# Altium schematic sheet RMP_SLIDER_MODULE.SchDoc
size Letter; SheetNumber: 4; SheetTotal: 7
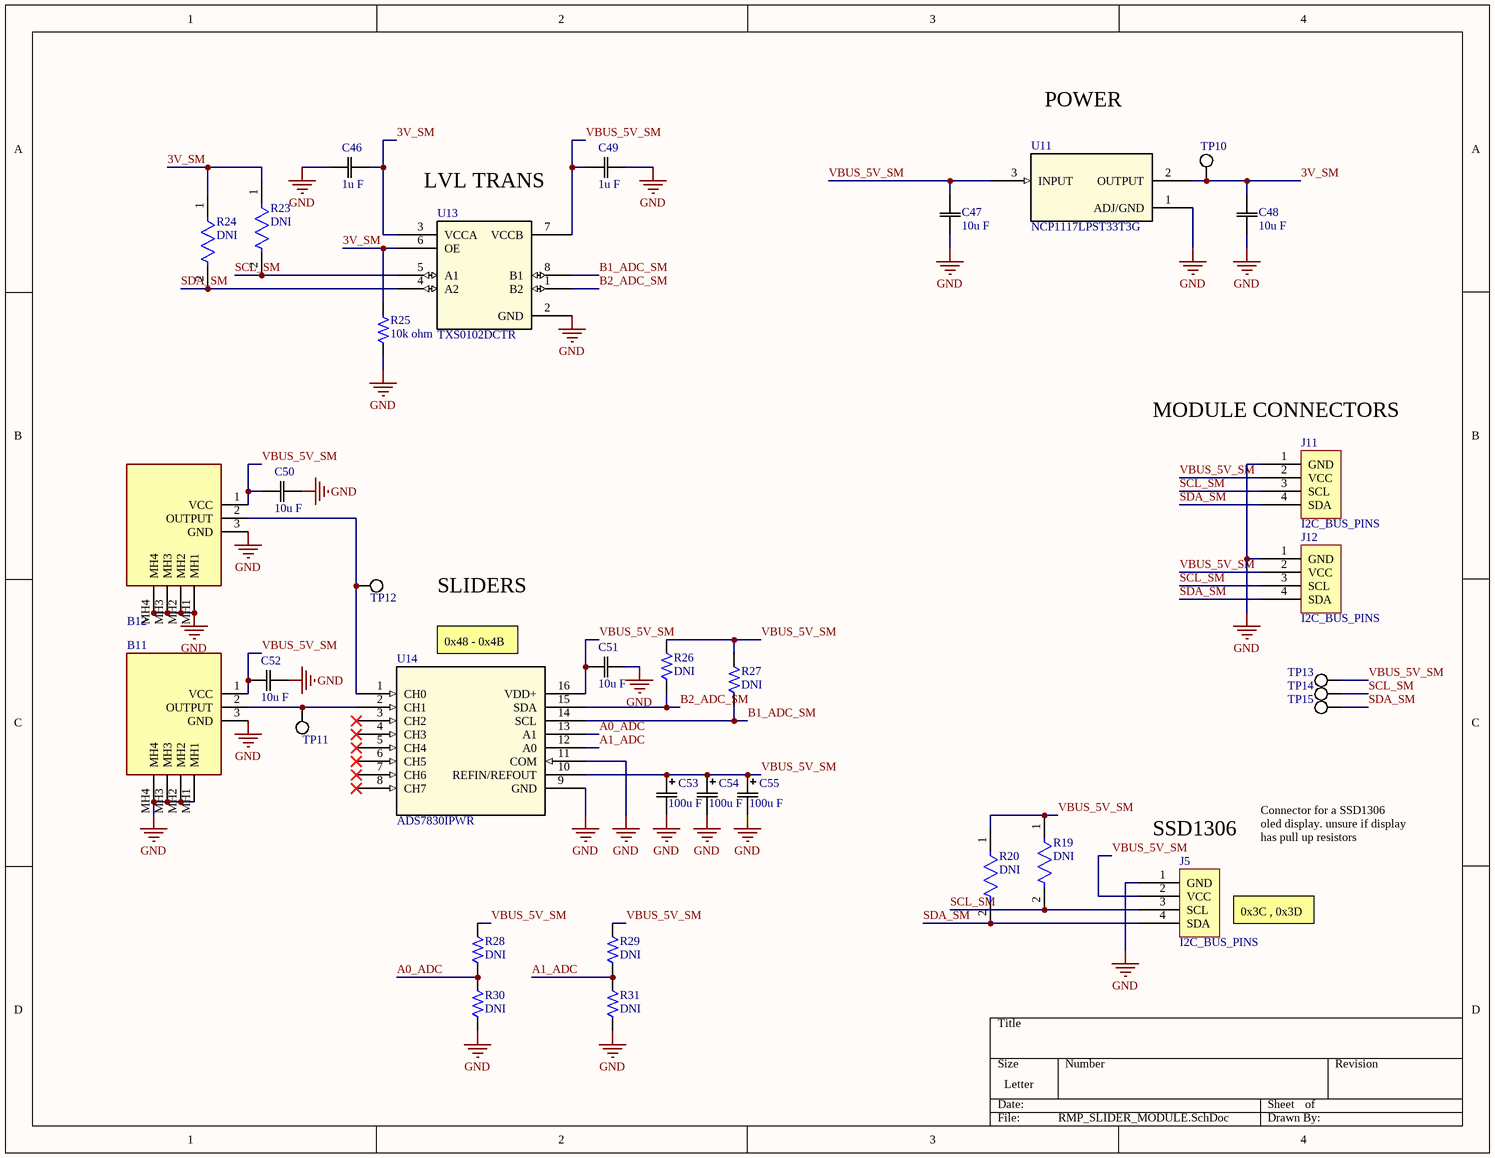
[diagram p0: RMP_SLIDER_MODULE.SchDoc]

## Parts
B11  PTA3043-2010CIB103  [PTA30432010CIB103]  (value not drawn)
B12  PTA3043-2010CIB103  [PTA30432010CIB103]  (value not drawn)
C46  value 1u F  [CAP_CL21B105KAFNNNE_SAM-M]  (hidden comment: CL21B105KAFNNNE)
C47  value 10u F  [G-21_MUR-M]  (hidden comment: GRM21BR61C106KE15K)
C48  value 10u F  [G-21_MUR-M]  (hidden comment: GRM21BR61C106KE15K)
C49  value 1u F  [CAP_CL21B105KAFNNNE_SAM-M]  (hidden comment: CL21B105KAFNNNE)
C50  value 10u F  [G-21_MUR-M]  (hidden comment: GRM21BR61C106KE15K)
C51  value 10u F  [G-21_MUR-M]  (hidden comment: GRM21BR61C106KE15K)
C52  value 10u F  [G-21_MUR-M]  (hidden comment: GRM21BR61C106KE15K)
C53  value 100u F  [CAP_YX_6P3X11_RUB]  (hidden comment: 35YXJ100M6.3X11)
C54  value 100u F  [CAP_YX_6P3X11_RUB]  (hidden comment: 35YXJ100M6.3X11)
C55  value 100u F  [CAP_YX_6P3X11_RUB]  (hidden comment: 35YXJ100M6.3X11)
J5  I2C_BUS_PINS  [4 PIN HEADER]
J11  I2C_BUS_PINS  [4 PIN HEADER]
J12  I2C_BUS_PINS  [4 PIN HEADER]
R19  Resistance: DNI  [FP-RT0805-MFG]  (hidden comment: RT0805FRE134K7L)
R20  Resistance: DNI  [FP-RT0805-MFG]  (hidden comment: RT0805FRE134K7L)
R23  Resistance: DNI  [FP-RT0805-MFG]  (hidden comment: RT0805FRE134K7L)
R24  Resistance: DNI  [FP-RT0805-MFG]  (hidden comment: RT0805FRE134K7L)
R25  value 10k ohm  [STA_RNCP0805_STP-M]  (hidden comment: RNCP0805FTD10K0)
R26  value DNI  [STA_RNCP0805_STP-M]  (hidden comment: RNCP0805FTD10K0)
R27  value DNI  [STA_RNCP0805_STP-M]  (hidden comment: RNCP0805FTD10K0)
R28  value DNI  [STA_RNCP0805_STP-M]  (hidden comment: RNCP0805FTD10K0)
R29  value DNI  [STA_RNCP0805_STP-M]  (hidden comment: RNCP0805FTD10K0)
R30  value DNI  [STA_RNCP0805_STP-M]  (hidden comment: RNCP0805FTD10K0)
R31  value DNI  [STA_RNCP0805_STP-M]  (hidden comment: RNCP0805FTD10K0)
TP10  TestPoint  [Testpoint]  (value not drawn)
TP11  TestPoint  [Testpoint]  (value not drawn)
TP12  TestPoint  [Testpoint]  (value not drawn)
TP13  TestPoint  [Testpoint]  (value not drawn)
TP14  TestPoint  [Testpoint]  (value not drawn)
TP15  TestPoint  [Testpoint]  (value not drawn)
U11  NCP1117LPST33T3G  [SOT223-3_ONS-M]
U13  TXS0102DCTR  [DCT8]
U14  ADS7830IPWR  [PW16-M]

## Nets
GND: B11.3(GND) B11.MH1 B11.MH2 B11.MH3 B11.MH4 B12.3(GND) B12.MH1 B12.MH2 B12.MH3 B12.MH4 C46.2 C47.1 C48.1 C49.1 C50.1 C51.1 C52.2 C53.2 C54.2 C55.2 J5.1(GND) J11.1(GND) J12.1(GND) R25.2 R30.1 R31.1 U11.1(ADJ/GND) U13.2(GND) U14.9(GND) U14.11(COM)
3V_SM: C46.1 C48.2 R23.1 R24.1 R25.1 TP10.1 U11.2(OUTPUT) U13.3(VCCA) U13.6(OE)
A0_ADC: R28.1 R30.2 U14.13(A1)
A1_ADC: R29.1 R31.2 U14.12(A0)
B1_ADC_SM: R27.1 U13.8(B1) U14.14(SCL)
B2_ADC_SM: R26.1 U13.1(B2) U14.15(SDA)
SCL_SM: J5.3(SCL) J11.3(SCL) J12.3(SCL) R19.2 R23.2 TP14.1 U13.5(A1)
SDA_SM: J5.4(SDA) J11.4(SDA) J12.4(SDA) R20.2 R24.2 TP15.1 U13.4(A2)
VBUS_5V_SM: B11.1(VCC) B12.1(VCC) C47.2 C49.2 C50.2 C51.2 C52.1 C53.1 C54.1 C55.1 J5.2(VCC) J11.2(VCC) J12.2(VCC) R19.1 R20.1 R26.2 R27.2 R28.2 R29.2 TP13.1 U11.3(INPUT) U13.7(VCCB) U14.10(REFIN/REFOUT) U14.16(VDD+)
NetB11_2: B11.2(OUTPUT) TP11.1 U14.2(CH1)
NetB12_2: B12.2(OUTPUT) TP12.1 U14.1(CH0)

Not connected (* = marked no-connect by the designer): U14 3(CH2)* 4(CH3)* 5(CH4)* 6(CH5)* 7(CH6)* 8(CH7)*

## Notes on the sheet
- POWER
- (near U13) LVL TRANS
- (near J11) MODULE CONNECTORS
- SLIDERS
- (near U14) 0x48 - 0x4B
- (near J5) SSD1306
- Connector for a SSD1306 oled display. unsure if display has pull up resistors
- 0x3C , 0x3D

## Library data of the parts
B11 B12 = PTA3043-2010CIB103: 10 kOhms 0.2W, 1/5W Through Hole Slide Potentiometer Top Adjustment Type; Manufacturer_Name: Bourns; Geometry.Height: 16.5mm; Manufacturer_Part_Number: PTA3043-2010CIB103; Mouser Part Number: 652-PTA3432010CIB103; Mouser Price/Stock: https://www.mouser.co.uk/ProductDetail/Bourns/PTA3043-2010CIB103?qs=QARuOjD9jaF0iQfIvhCxcQ%3D%3D; Arrow Part Number: PTA3043-2010CIB103; Arrow Price/Stock: null?utm_currency=USD&region=nac; Datasheet Link: https://www.bourns.com/docs/Product-Datasheets/pta.pdf
C46 C49 = CAP_CL21B105KAFNNNE: 1 µF ±10% 25V Ceramic Capacitor X7R 0805 (2012 Metric); Mfr_Name: Samsung
C47 C48 C50-C52 = CAP_GRM21BR61C106KE15K: 10 µF ±10% 16V Ceramic Capacitor X5R 0805 (2012 Metric); Mfr_Name: Murata
C53-C55 = CAP_35YXJ100M6.3X11: CAP ALUM 100UF 20% 35V RADIAL TH; Mfr_Name: Rubycon
R19 R20 R23 R24 = CMP-03412-025396-1: RT0805 4.7KΩ 0.125W 50 ppm/°C 0.01%; Manufacturer: Yageo; Tolerance: 0.0001; Voltage Rating: 150V; Category: Res; Footprint Url: http://www.yageo.com/exep/pages/download/literatures/PYu-R_Mount_10.pdf; Package: RT0805; Composition: Thin Film; Device Class L3: Chip SMD Resistors; Ipc Land Pattern Name: RESC200125X50; Temperature Range Low: -55°C; Lead Free: Yes; Temperature Range High: +155°C; Temperature Coefficient: 50 ppm/°C; Octopart: https://octopart.com/rt0805fre134k7l-yageo-16262042; ComponentLink2URL: http://www.yageo.com/documents/recent/PYu-RT_1-to-0.01_RoHS_L_9.pdf; Device Class L1: Passive Components; Value: 4.7KΩ; Automotive: No; Height: 0.6mm; Device Class L2: Resistors; RoHS: TRUE; Manufacturer Part Number: RT0805FRE134K7L; Power Rating: 0.125W; Temperature: -55°C to +155°C; Series: RT; ComponentLink2Description: Datasheet
R25-R31 = RES_RNCP0805FTD10K0: 10 kOhms ±1% 0.25W, 1/4W Chip Resistor 0805 (2012 Metric) Anti-Sulfur Thin Film; Supplier 1: Digikey; Supplier Part Number 1: RNCP0805FTD10K0CT-ND
U11 = NCP1117LPST33T3G: Linear Voltage Regulator IC Positive Fixed 1 Output 1A SOT-223; Mfr_Name: onsemi; RefDes: RefDes; Type: Type
U13 = TXS0102DCTR: Voltage Level Translator Bidirectional 1 Circuit 2 Channel 24Mbps SM8; Mfr_Name: Texas Instruments; RefDes: RefDes; Type: Type
U14 = ADS7830IPWR: 8 Bit Analog to Digital Converter 4, 8 Input 1 SAR 16-TSSOP; Mfr_Name: Texas Instruments; RefDes: RefDes; Type: Type